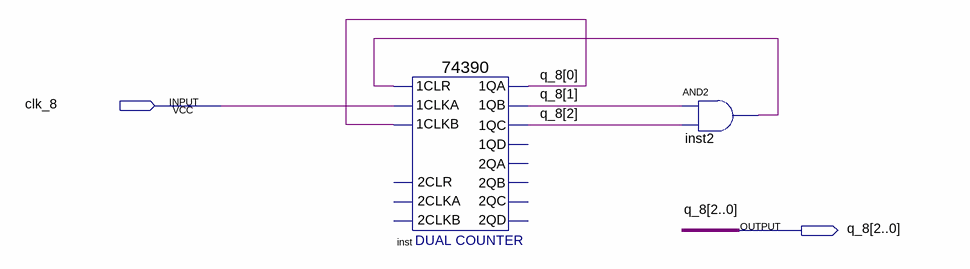
[diagram p0: schematic sheet]
// Quartus schematic cnt6_8.bdf as structural Verilog: 2 symbols, 2 pins
module cnt6_8 (
  input  clk_8,
  output [2:0] q_8
);

  wire inst2_out;

  \74390  inst (
    .\1CLR (inst2_out), .\1CLKA (clk_8), .\1CLKB (q_8[0]), .\1QA (q_8[0]), .\1QB (q_8[1]), .\1QC (q_8[2]));  // open: 2CLKA, 2CLR, 2CLKB, 1QD, 2QA, 2QB, 2QC, 2QD
  and inst2 (inst2_out, q_8[1], q_8[2]);
endmodule
